# EAGLE design piezo-layer_v0.2-R001 (EAGLE 6.5.0)
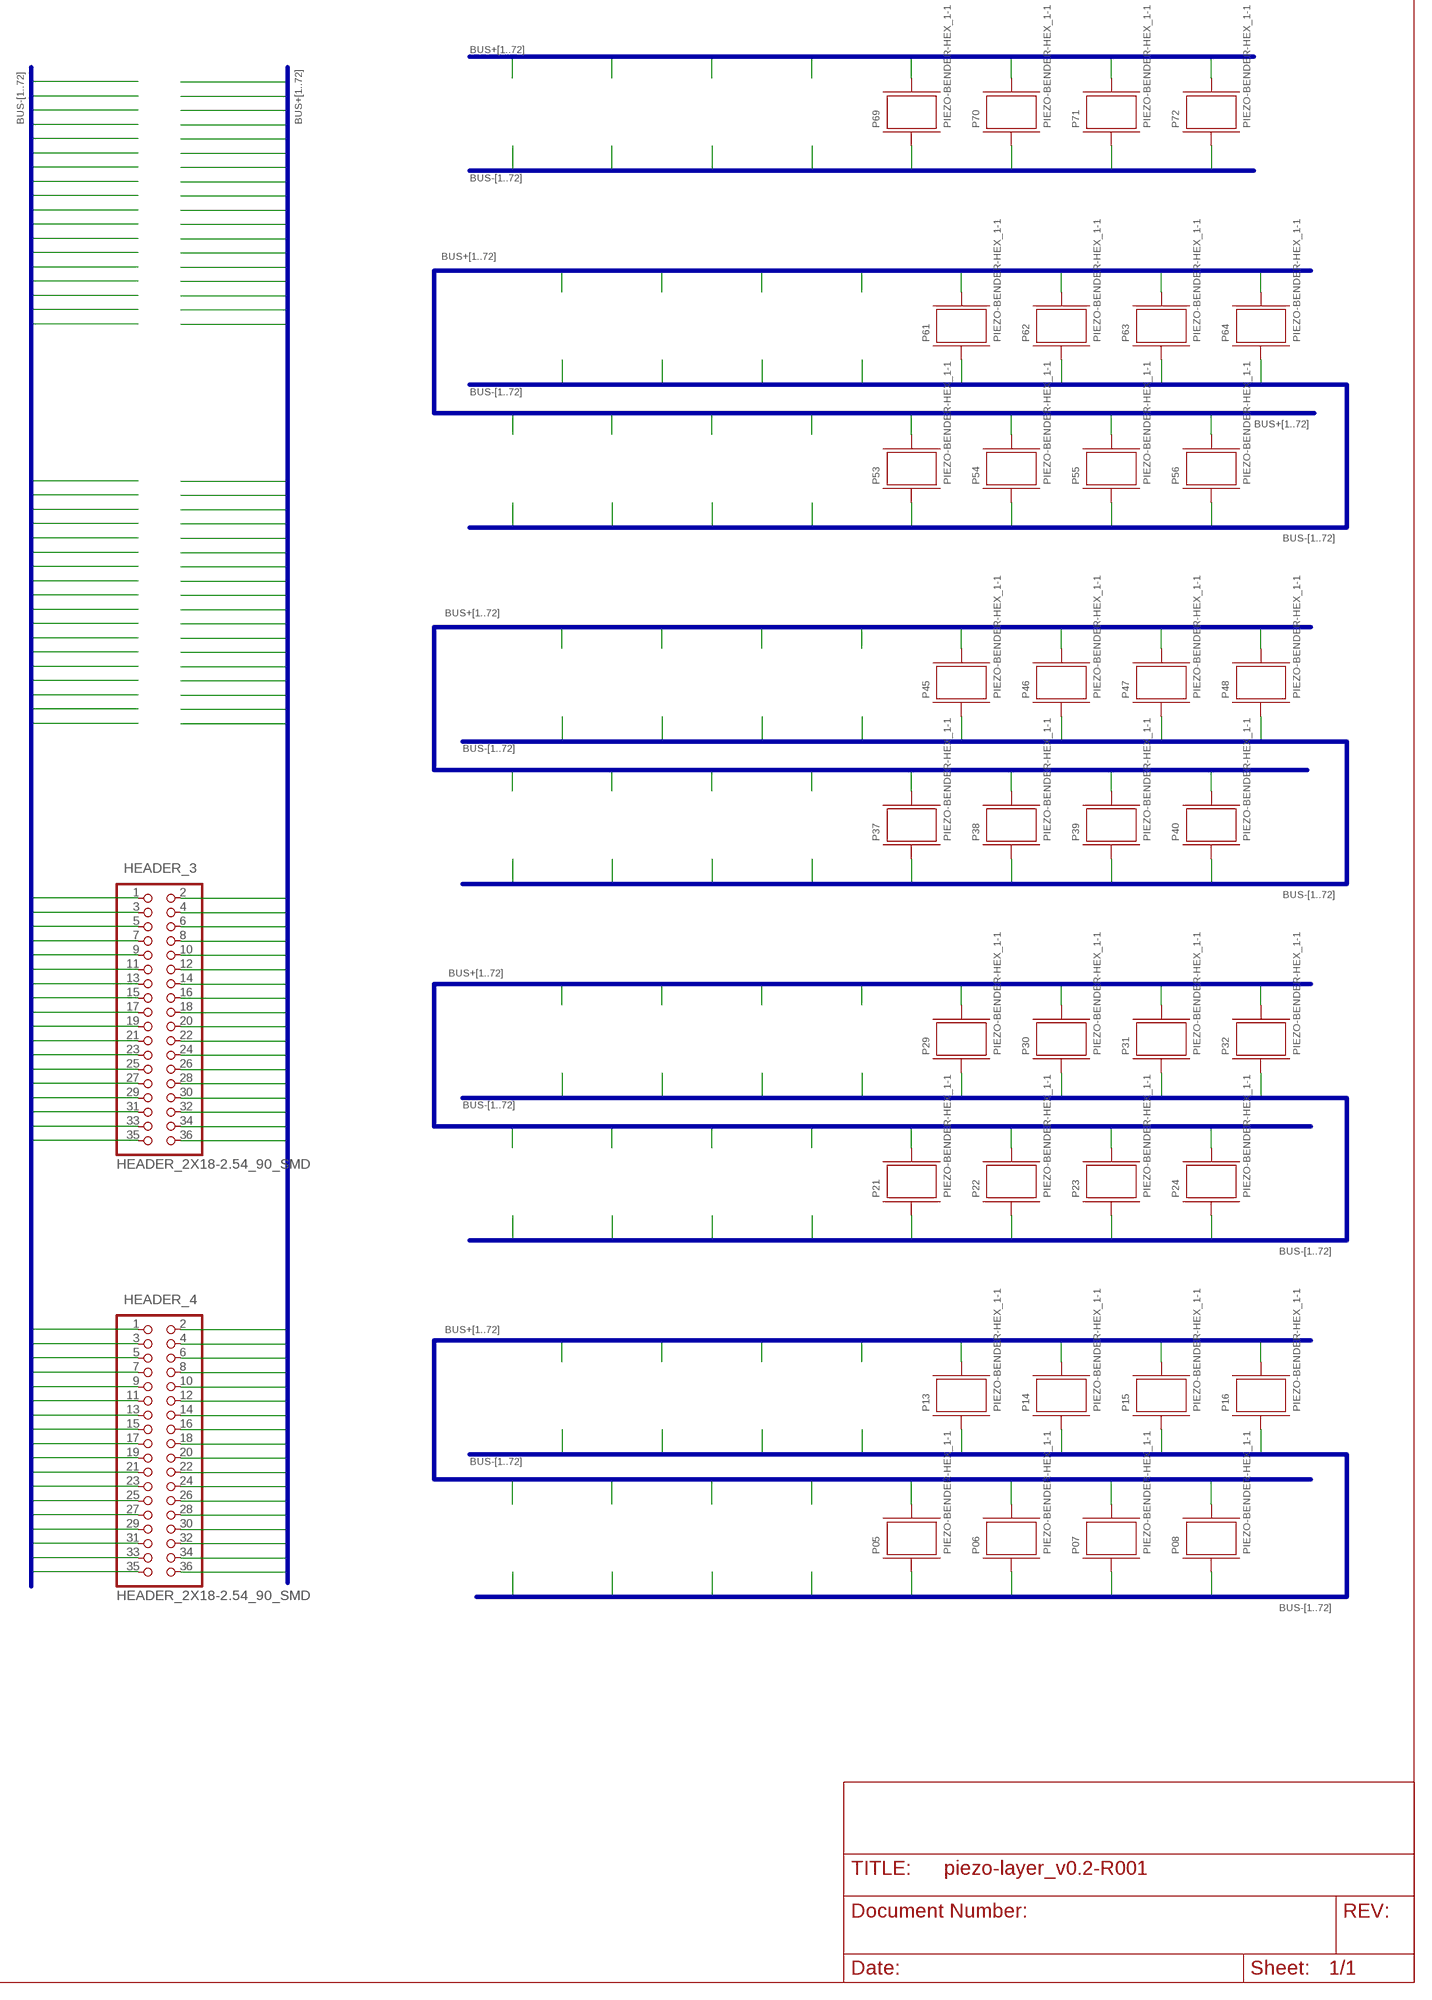
[diagram p0: schematic, sheet 1]

## Parts
HEADER_3  HEADER_2X18-2.54_90_SMD  [2X18_2.54_90_SMD]
HEADER_4  HEADER_2X18-2.54_90_SMD  [2X18_2.54_90_SMD]
P05  PIEZO-BENDER-HEX_1-1  [PIEZO-BENDER-HEX_16MM_1+_1-]
P06  PIEZO-BENDER-HEX_1-1  [PIEZO-BENDER-HEX_16MM_1+_1-]
P07  PIEZO-BENDER-HEX_1-1  [PIEZO-BENDER-HEX_16MM_1+_1-]
P08  PIEZO-BENDER-HEX_1-1  [PIEZO-BENDER-HEX_16MM_1+_1-]
P13  PIEZO-BENDER-HEX_1-1  [PIEZO-BENDER-HEX_16MM_1+_1-]
P14  PIEZO-BENDER-HEX_1-1  [PIEZO-BENDER-HEX_16MM_1+_1-]
P15  PIEZO-BENDER-HEX_1-1  [PIEZO-BENDER-HEX_16MM_1+_1-]
P16  PIEZO-BENDER-HEX_1-1  [PIEZO-BENDER-HEX_16MM_1+_1-]
P21  PIEZO-BENDER-HEX_1-1  [PIEZO-BENDER-HEX_16MM_1+_1-]
P22  PIEZO-BENDER-HEX_1-1  [PIEZO-BENDER-HEX_16MM_1+_1-]
P23  PIEZO-BENDER-HEX_1-1  [PIEZO-BENDER-HEX_16MM_1+_1-]
P24  PIEZO-BENDER-HEX_1-1  [PIEZO-BENDER-HEX_16MM_1+_1-]
P29  PIEZO-BENDER-HEX_1-1  [PIEZO-BENDER-HEX_16MM_1+_1-]
P30  PIEZO-BENDER-HEX_1-1  [PIEZO-BENDER-HEX_16MM_1+_1-]
P31  PIEZO-BENDER-HEX_1-1  [PIEZO-BENDER-HEX_16MM_1+_1-]
P32  PIEZO-BENDER-HEX_1-1  [PIEZO-BENDER-HEX_16MM_1+_1-]
P37  PIEZO-BENDER-HEX_1-1  [PIEZO-BENDER-HEX_16MM_1+_1-]
P38  PIEZO-BENDER-HEX_1-1  [PIEZO-BENDER-HEX_16MM_1+_1-]
P39  PIEZO-BENDER-HEX_1-1  [PIEZO-BENDER-HEX_16MM_1+_1-]
P40  PIEZO-BENDER-HEX_1-1  [PIEZO-BENDER-HEX_16MM_1+_1-]
P45  PIEZO-BENDER-HEX_1-1  [PIEZO-BENDER-HEX_16MM_1+_1-]
P46  PIEZO-BENDER-HEX_1-1  [PIEZO-BENDER-HEX_16MM_1+_1-]
P47  PIEZO-BENDER-HEX_1-1  [PIEZO-BENDER-HEX_16MM_1+_1-]
P48  PIEZO-BENDER-HEX_1-1  [PIEZO-BENDER-HEX_16MM_1+_1-]
P53  PIEZO-BENDER-HEX_1-1  [PIEZO-BENDER-HEX_16MM_1+_1-]
P54  PIEZO-BENDER-HEX_1-1  [PIEZO-BENDER-HEX_16MM_1+_1-]
P55  PIEZO-BENDER-HEX_1-1  [PIEZO-BENDER-HEX_16MM_1+_1-]
P56  PIEZO-BENDER-HEX_1-1  [PIEZO-BENDER-HEX_16MM_1+_1-]
P61  PIEZO-BENDER-HEX_1-1  [PIEZO-BENDER-HEX_16MM_1+_1-]
P62  PIEZO-BENDER-HEX_1-1  [PIEZO-BENDER-HEX_16MM_1+_1-]
P63  PIEZO-BENDER-HEX_1-1  [PIEZO-BENDER-HEX_16MM_1+_1-]
P64  PIEZO-BENDER-HEX_1-1  [PIEZO-BENDER-HEX_16MM_1+_1-]
P69  PIEZO-BENDER-HEX_1-1  [PIEZO-BENDER-HEX_16MM_1+_1-]
P70  PIEZO-BENDER-HEX_1-1  [PIEZO-BENDER-HEX_16MM_1+_1-]
P71  PIEZO-BENDER-HEX_1-1  [PIEZO-BENDER-HEX_16MM_1+_1-]
P72  PIEZO-BENDER-HEX_1-1  [PIEZO-BENDER-HEX_16MM_1+_1-]

## Nets
BUS+5: HEADER_3.18 P05.TIP1(+_1)
BUS+6: HEADER_3.36 P06.TIP1(+_1)
BUS+7: HEADER_4.18 P07.TIP1(+_1)
BUS+8: HEADER_4.36 P08.TIP1(+_1)
BUS+13: HEADER_3.16 P13.TIP1(+_1)
BUS+14: HEADER_3.34 P14.TIP1(+_1)
BUS+15: HEADER_4.16 P15.TIP1(+_1)
BUS+16: HEADER_4.34 P16.TIP1(+_1)
BUS+21: HEADER_3.14 P21.TIP1(+_1)
BUS+22: HEADER_3.32 P22.TIP1(+_1)
BUS+23: HEADER_4.14 P23.TIP1(+_1)
BUS+24: HEADER_4.32 P24.TIP1(+_1)
BUS+29: HEADER_3.12 P29.TIP1(+_1)
BUS+30: HEADER_3.30 P30.TIP1(+_1)
BUS+31: HEADER_4.12 P31.TIP1(+_1)
BUS+32: HEADER_4.30 P32.TIP1(+_1)
BUS+37: HEADER_3.10 P37.TIP1(+_1)
BUS+38: HEADER_3.28 P38.TIP1(+_1)
BUS+39: HEADER_4.10 P39.TIP1(+_1)
BUS+40: HEADER_4.28 P40.TIP1(+_1)
BUS+45: HEADER_3.8 P45.TIP1(+_1)
BUS+46: HEADER_3.26 P46.TIP1(+_1)
BUS+47: HEADER_4.8 P47.TIP1(+_1)
BUS+48: HEADER_4.26 P48.TIP1(+_1)
BUS+53: HEADER_3.6 P53.TIP1(+_1)
BUS+54: HEADER_3.24 P54.TIP1(+_1)
BUS+55: HEADER_4.6 P55.TIP1(+_1)
BUS+56: HEADER_4.24 P56.TIP1(+_1)
BUS+61: HEADER_3.4 P61.TIP1(+_1)
BUS+62: HEADER_3.22 P62.TIP1(+_1)
BUS+63: HEADER_4.4 P63.TIP1(+_1)
BUS+64: HEADER_4.22 P64.TIP1(+_1)
BUS+69: HEADER_3.2 P69.TIP1(+_1)
BUS+70: HEADER_3.20 P70.TIP1(+_1)
BUS+71: HEADER_4.2 P71.TIP1(+_1)
BUS+72: HEADER_4.20 P72.TIP1(+_1)
BUS-5: HEADER_3.17 P05.PAD1(-_1)
BUS-6: HEADER_3.35 P06.PAD1(-_1)
BUS-7: HEADER_4.17 P07.PAD1(-_1)
BUS-8: HEADER_4.35 P08.PAD1(-_1)
BUS-13: HEADER_3.15 P13.PAD1(-_1)
BUS-14: HEADER_3.33 P14.PAD1(-_1)
BUS-15: HEADER_4.15 P15.PAD1(-_1)
BUS-16: HEADER_4.33 P16.PAD1(-_1)
BUS-21: HEADER_3.13 P21.PAD1(-_1)
BUS-22: HEADER_3.31 P22.PAD1(-_1)
BUS-23: HEADER_4.13 P23.PAD1(-_1)
BUS-24: HEADER_4.31 P24.PAD1(-_1)
BUS-29: HEADER_3.11 P29.PAD1(-_1)
BUS-30: HEADER_3.29 P30.PAD1(-_1)
BUS-31: HEADER_4.11 P31.PAD1(-_1)
BUS-32: HEADER_4.29 P32.PAD1(-_1)
BUS-37: HEADER_3.9 P37.PAD1(-_1)
BUS-38: HEADER_3.27 P38.PAD1(-_1)
BUS-39: HEADER_4.9 P39.PAD1(-_1)
BUS-40: HEADER_4.27 P40.PAD1(-_1)
BUS-45: HEADER_3.7 P45.PAD1(-_1)
BUS-46: HEADER_3.25 P46.PAD1(-_1)
BUS-47: HEADER_4.7 P47.PAD1(-_1)
BUS-48: HEADER_4.25 P48.PAD1(-_1)
BUS-53: HEADER_3.5 P53.PAD1(-_1)
BUS-54: HEADER_3.23 P54.PAD1(-_1)
BUS-55: HEADER_4.5 P55.PAD1(-_1)
BUS-56: HEADER_4.23 P56.PAD1(-_1)
BUS-61: HEADER_3.3 P61.PAD1(-_1)
BUS-62: HEADER_3.21 P62.PAD1(-_1)
BUS-63: HEADER_4.3 P63.PAD1(-_1)
BUS-64: HEADER_4.21 P64.PAD1(-_1)
BUS-69: HEADER_3.1 P69.PAD1(-_1)
BUS-70: HEADER_3.19 P70.PAD1(-_1)
BUS-71: HEADER_4.1 P71.PAD1(-_1)
BUS-72: HEADER_4.19 P72.PAD1(-_1)

## Buses
BUS+[1..72]
BUS-[1..72]

## Library data of the parts
HEADER_3 HEADER_4 = SABRe:HEADER_2X18
P05-P08 P13-P16 P21-P24 P29-P32 P37-P40 P45-P48 P53-P56 P61-P64 P69-P72 = ICST:PIEZO-BENDER-HEX_1-1

## Board
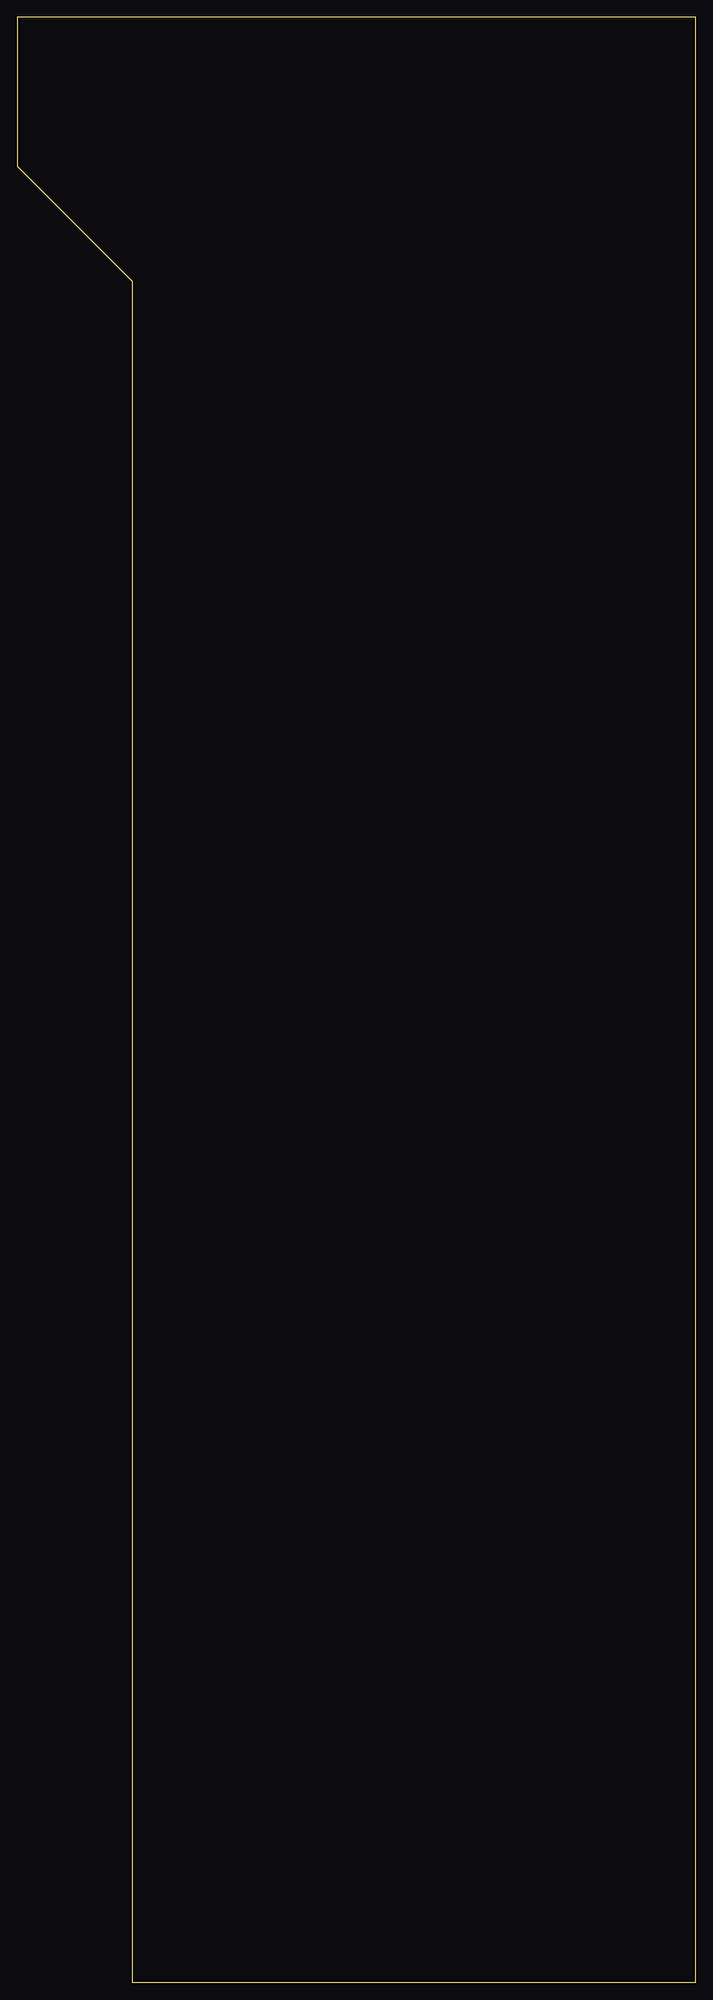
[diagram p1: board, top side]
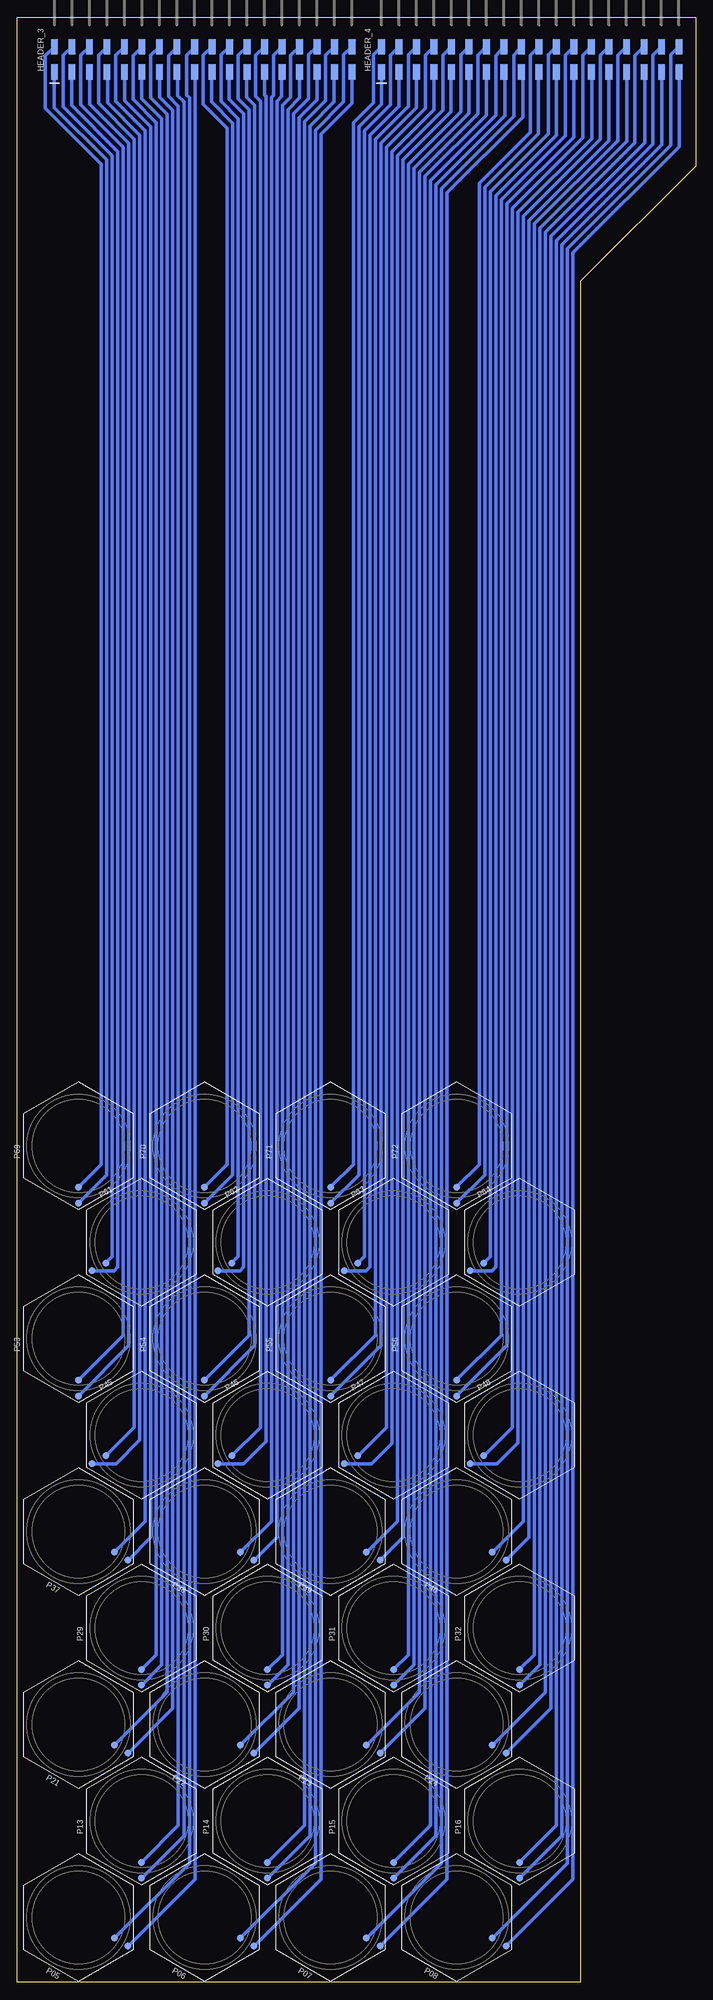
[diagram p2: board, bottom side, seen from below]

Size 98.5 x 285.2 mm. Coordinates in mm from the lower left corner, seen from the top.
Outline: 16.7,0 98.5,0 98.5,285.2 0,285.2 0,263.6 16.7,246.9 16.7,0
Copper layers (1*16): Top 0.009mm / dielectric 0.2mm / Bottom 0.018mm
Design rules "1L-0.2-0.15_0.3mm *": minimum track width 0.2mm, minimum drill 0.3mm, track to track 0.15mm, track to pad 0.15mm, pad to pad 0.15mm, via to via 0.15mm, smd to smd 0.15mm, copper to edge 0.5mm, drill to drill 1mm, minimum pad ring 10mil, minimum via ring 8mil, stop-mask expansion 4mil, vias tented up to drill 0mil, thermal gap 10mil

### Footprints (pad centres in the part's own frame; a part is rotated, then mirrored left to right if it is on the bottom)
2X18_2.54_90_SMD = smd 1 x 2.2: 1 -21.59,-1.84; 2 -21.59,1.84; 3 -19.05,-1.84; 4 -19.05,1.84; 5 -16.51,-1.84; 6 -16.51,1.84; 7 -13.97,-1.84; 8 -13.97,1.84; 9 -11.43,-1.84; 10 -11.43,1.84; 11 -8.89,-1.84; 12 -8.89,1.84; 13 -6.35,-1.84; 14 -6.35,1.84; 15 -3.81,-1.84; 16 -3.81,1.84; 17 -1.27,-1.84; 18 -1.27,1.84; 19 1.27,-1.84; 20 1.27,1.84; 21 3.81,-1.84; 22 3.81,1.84; 23 6.35,-1.84; 24 6.35,1.84; 25 8.89,-1.84; 26 8.89,1.84; 27 11.43,-1.84; 28 11.43,1.84; 29 13.97,-1.84; 30 13.97,1.84; 31 16.51,-1.84; 32 16.51,1.84; 33 19.05,-1.84; 34 19.05,1.84; 35 21.59,-1.84; 36 21.59,1.84
PIEZO-BENDER-HEX_16MM_1+_1- = smd 1 x 1: PAD1 -8.3,0; TIP1 -6,0

### Placement (x,y rotation side)
HEADER_3  71.5,279.1 0 bottom
HEADER_4  24,279.1 0 bottom
P05  89.6,9.4 150 bottom
P06  71.3,9.4 150 bottom
P07  53,9.4 150 bottom
P08  34.7,9.4 150 bottom
P13  80.45,23.4 90 bottom
P14  62.15,23.4 90 bottom
P15  43.85,23.4 90 bottom
P16  25.55,23.4 90 bottom
P21  89.6,37.4 150 bottom
P22  71.3,37.4 150 bottom
P23  53,37.4 150 bottom
P24  34.7,37.4 150 bottom
P29  80.45,51.4 90 bottom
P30  62.15,51.4 90 bottom
P31  43.85,51.4 90 bottom
P32  25.55,51.4 90 bottom
P37  89.6,65.4 150 bottom
P38  71.3,65.4 150 bottom
P39  53,65.4 150 bottom
P40  34.7,65.4 150 bottom
P45  80.45,79.4 30 bottom
P46  62.15,79.4 30 bottom
P47  43.85,79.4 30 bottom
P48  25.55,79.4 30 bottom
P53  89.6,93.4 90 bottom
P54  71.3,93.4 90 bottom
P55  53,93.4 90 bottom
P56  34.7,93.4 90 bottom
P61  80.45,107.4 30 bottom
P62  62.15,107.4 30 bottom
P63  43.85,107.4 30 bottom
P64  25.55,107.4 30 bottom
P69  89.6,121.4 90 bottom
P70  71.3,121.4 90 bottom
P71  53,121.4 90 bottom
P72  34.7,121.4 90 bottom

### Tracks (layer width: path | path; a pad name or v marks a point on that pad's centre or on a via)
BUS+5
  Bottom 0.5: P05.TIP1 73.5,17.3 73.5,273.5 73.9,273.9 73.9,279.68 72.69,280.89 | 72.64,280.94 72.69,280.89 | HEADER_3.18 72.72,280.89 72.69,280.89
BUS+6
  Bottom 0.5: P06.TIP1 55.2,17.3 55.2,268.8 51.1,272.9 51.1,279.75 HEADER_3.36
BUS+7
  Bottom 0.5: P07.TIP1 36.9,17.3 36.9,260.3 26.4,270.8 26.4,279.68 HEADER_4.18
BUS+8
  Bottom 0.5: P08.TIP1 18.6,17.3 18.6,251.6 3.6,266.6 3.6,279.75 HEADER_4.36
BUS+13
  Bottom 0.5: P13.TIP1 75.1,22.75 75.1,272.3 76.5,273.7 76.5,279.62 75.18,280.94 HEADER_3.16
BUS+14
  Bottom 0.5: P14.TIP1 56.8,22.75 56.8,270 53.7,273.1 53.7,279.69 HEADER_3.34
BUS+15
  Bottom 0.5: P15.TIP1 38.5,22.75 38.5,261.5 29,271 29,279.62 HEADER_4.16
BUS+16
  Bottom 0.5: P16.TIP1 20.2,22.75 20.2,252.8 6.2,266.8 6.2,279.69 HEADER_4.34
BUS+21
  Bottom 0.5: P21.TIP1 76.7,42.1 76.7,271.1 79.1,273.5 79.1,279.69 HEADER_3.14
BUS+22
  Bottom 0.5: P22.TIP1 58.4,42.1 58.4,271.2 56.2,273.4 56.2,279.73 HEADER_3.32
BUS+23
  Bottom 0.5: P23.TIP1 40.1,42.1 40.1,262.7 31.6,271.2 31.6,279.69 HEADER_4.14
BUS+24
  Bottom 0.5: P24.TIP1 21.8,42.1 21.8,254 8.8,267 8.8,279.63 HEADER_4.32
BUS+29
  Bottom 0.5: P29.TIP1 78.3,47.55 78.3,269.9 81.7,273.3 81.7,279.63 HEADER_3.12
BUS+30
  Bottom 0.5: P30.TIP1 60,47.55 60,272.4 58.8,273.6 58.8,279.67 HEADER_3.30
BUS+31
  Bottom 0.5: P31.TIP1 41.7,47.55 41.7,263.9 34.1,271.5 34.1,279.73 HEADER_4.12
BUS+32
  Bottom 0.5: P32.TIP1 23.4,47.55 23.4,255.2 11.3,267.3 11.3,279.67 HEADER_4.30
BUS+37
  Bottom 0.5: P37.TIP1 79.9,66.9 79.9,268.7 84.2,273 84.2,279.67 HEADER_3.10
BUS+38
  Bottom 0.5: P38.TIP1 61.6,66.9 61.6,273.6 61.3,273.9 61.3,279.71 HEADER_3.28
BUS+39
  Bottom 0.5: P39.TIP1 43.3,66.9 43.3,265.1 36.7,271.7 36.7,279.67 HEADER_4.10
BUS+40
  Bottom 0.5: P40.TIP1 25,66.9 25,256.3 13.8,267.5 13.8,279.71 HEADER_4.28
BUS+45
  Bottom 0.5: P45.TIP1 81.5,80.55 81.5,267.5 86.7,272.7 86.7,279.71 HEADER_3.8
BUS+46
  Bottom 0.5: P46.TIP1 63.2,80.55 63.2,273 63.9,273.7 63.9,279.65 HEADER_3.26
BUS+47
  Bottom 0.5: P47.TIP1 44.9,80.55 44.9,266.3 39.2,272 39.2,279.71 HEADER_4.8
BUS+48
  Bottom 0.5: P48.TIP1 26.6,80.55 26.6,257.5 16.4,267.7 16.4,279.65 HEADER_4.26
BUS+53
  Bottom 0.5: P53.TIP1 83.1,93.9 83.1,266.3 89.3,272.5 89.3,279.65 HEADER_3.6
BUS+54
  Bottom 0.5: P54.TIP1 64.8,93.9 64.8,271.8 66.4,273.4 66.4,279.69 HEADER_3.24
BUS+55
  Bottom 0.5: P55.TIP1 46.5,93.9 46.5,267.5 41.7,272.3 41.7,279.75 HEADER_4.6
BUS+56
  Bottom 0.5: P56.TIP1 28.2,93.9 28.2,258.7 18.9,268 18.9,279.69 HEADER_4.24
BUS+61
  Bottom 0.5: P61.TIP1 84.7,105.35 84.7,265.1 91.8,272.2 91.8,279.69 HEADER_3.4
BUS+62
  Bottom 0.5: P62.TIP1 66.4,105.35 66.4,270.5 68.9,273 68.9,279.73 HEADER_3.22
BUS+63
  Bottom 0.5: P63.TIP1 48.1,105.35 48.1,268.7 44.3,272.5 44.3,279.69 HEADER_4.4
BUS+64
  Bottom 0.5: P64.TIP1 29.8,105.35 29.8,259.9 21.4,268.3 21.4,279.73 HEADER_4.22
BUS+69
  Bottom 0.5: P69.TIP1 86.3,118.7 86.3,263.9 94.4,272 94.4,279.63 HEADER_3.2
BUS+70
  Bottom 0.5: P70.TIP1 68,118.7 68,269.1 71.5,272.6 71.5,279.67 HEADER_3.20
BUS+71
  Bottom 0.5: P71.TIP1 49.7,118.7 49.7,269.9 46.8,272.8 46.8,279.73 HEADER_4.2
BUS+72
  Bottom 0.5: P72.TIP1 31.4,118.7 31.4,261.1 24,268.5 24,279.67 HEADER_4.20
BUS-5
  Bottom 0.5: P05.PAD1 72.7,14.96 72.7,277.2 | 72.64,277.26 72.7,277.2 | 72.7,277.2 72.76,277.26 HEADER_3.17
BUS-6
  Bottom 0.5: P06.PAD1 54.4,14.96 54.4,268.2 49.9,272.7 HEADER_3.35
BUS-7
  Bottom 0.5: P07.PAD1 36.1,14.96 36.1,259.7 25.1,270.7 25.1,277.22 HEADER_4.17
BUS-8
  Bottom 0.5: P08.PAD1 17.8,14.96 17.8,251 2.4,266.4 HEADER_4.35
BUS-13
  Bottom 0.5: P13.PAD1 74.3,21.25 74.3,272.9 75.2,273.8 75.2,277.15 | 75.18,277.26 75.2,277.24 75.2,277.15 | HEADER_3.15 75.2,277.15
BUS-14
  Bottom 0.5: P14.PAD1 56,21.25 56,269.4 52.5,272.9 52.5,277.21 HEADER_3.33
BUS-15
  Bottom 0.5: P15.PAD1 37.7,21.25 37.7,260.9 27.7,270.9 27.7,277.24 HEADER_4.15
BUS-16
  Bottom 0.5: P16.PAD1 19.4,21.25 19.4,252.2 4.9,266.7 4.9,277.21 HEADER_4.33
BUS-21
  Bottom 0.5: P21.PAD1 75.9,39.76 75.9,271.7 77.8,273.6 77.8,277.21 HEADER_3.13
BUS-22
  Bottom 0.5: P22.PAD1 57.6,39.76 57.6,270.6 55,273.2 HEADER_3.31
BUS-23
  Bottom 0.5: P23.PAD1 39.3,39.76 39.3,262.1 30.4,271 30.4,277.21 HEADER_4.13
BUS-24
  Bottom 0.5: P24.PAD1 21,39.76 21,253.4 7.4,267 7.4,277.17 HEADER_4.31
BUS-29
  Bottom 0.5: P29.PAD1 77.5,46.05 77.5,270.5 80.4,273.4 HEADER_3.11
BUS-30
  Bottom 0.5: P30.PAD1 59.2,46.05 59.2,271.8 57.5,273.5 57.5,277.23 HEADER_3.29
BUS-31
  Bottom 0.5: P31.PAD1 40.9,46.05 40.9,263.3 32.9,271.3 HEADER_4.11
BUS-32
  Bottom 0.5: P32.PAD1 22.6,46.05 22.6,254.6 10,267.2 10,277.23 HEADER_4.29
BUS-37
  Bottom 0.5: P37.PAD1 79.1,64.56 79.1,269.3 82.9,273.1 82.9,277.23 HEADER_3.9
BUS-38
  Bottom 0.5: P38.PAD1 60.8,64.56 60.8,273 60.1,273.7 60.1,277.23 HEADER_3.27
BUS-39
  Bottom 0.5: P39.PAD1 42.5,64.56 42.5,264.5 35.5,271.5 35.5,277.19 HEADER_4.9
BUS-40
  Bottom 0.5: P40.PAD1 24.2,64.56 24.2,255.7 12.6,267.3 12.6,277.23 HEADER_4.27
BUS-45
  Bottom 0.5: P45.PAD1 84.15,75.25 80.7,78.7 80.7,268.1 85.4,272.8 85.4,277.19 HEADER_3.7
BUS-46
  Bottom 0.5: P46.PAD1 65.65,75.25 62.4,78.5 62.4,273.7 62.6,273.9 HEADER_3.25
BUS-47
  Bottom 0.5: P47.PAD1 47.05,75.25 44.1,78.2 44.1,265.7 38,271.8 38,277.23 HEADER_4.7
BUS-48
  Bottom 0.5: P48.PAD1 28.85,75.25 25.8,78.3 25.8,256.9 15.1,267.6 HEADER_4.25
BUS-53
  Bottom 0.5: P53.PAD1 82.3,92.4 82.3,266.9 88,272.6 HEADER_3.5
BUS-54
  Bottom 0.5: P54.PAD1 64,92.4 64,272.4 65.2,273.6 65.2,277.21 HEADER_3.23
BUS-55
  Bottom 0.5: P55.PAD1 45.7,92.4 45.7,266.9 40.5,272.1 HEADER_4.5
BUS-56
  Bottom 0.5: P56.PAD1 27.4,92.4 27.4,258.1 17.7,267.8 17.7,277.21 HEADER_4.23
BUS-61
  Bottom 0.5: P61.PAD1 84.45,103.25 83.9,103.8 83.9,265.7 90.6,272.4 90.6,277.21 HEADER_3.3
BUS-62
  Bottom 0.5: P62.PAD1 66.15,103.25 65.6,103.8 65.6,271.2 67.7,273.3 HEADER_3.21
BUS-63
  Bottom 0.5: P63.PAD1 47.85,103.25 47.3,103.8 47.3,268.1 43.1,272.3 43.1,277.21 HEADER_4.3
BUS-64
  Bottom 0.5: P64.PAD1 29.55,103.25 29,103.8 29,259.3 20.2,268.1 HEADER_4.21
BUS-69
  Bottom 0.5: P69.PAD1 85.5,117.2 85.5,264.5 93.1,272.1 HEADER_3.1
BUS-70
  Bottom 0.5: P70.PAD1 67.2,117.2 67.2,269.8 70.3,272.9 70.3,277.19 HEADER_3.19
BUS-71
  Bottom 0.5: P71.PAD1 48.9,117.2 48.9,269.3 45.6,272.6 HEADER_4.1
BUS-72
  Bottom 0.5: P72.PAD1 30.6,117.2 30.6,260.5 22.8,268.3 22.8,277.19 HEADER_4.19